# EAGLE design Shield_Proto (EAGLE 9.4.0)
COMPANY: Unexpected Maker; DATE: 24-10-2018; DRAWN: Seon; REV: V1; TITLE: TinyPICO
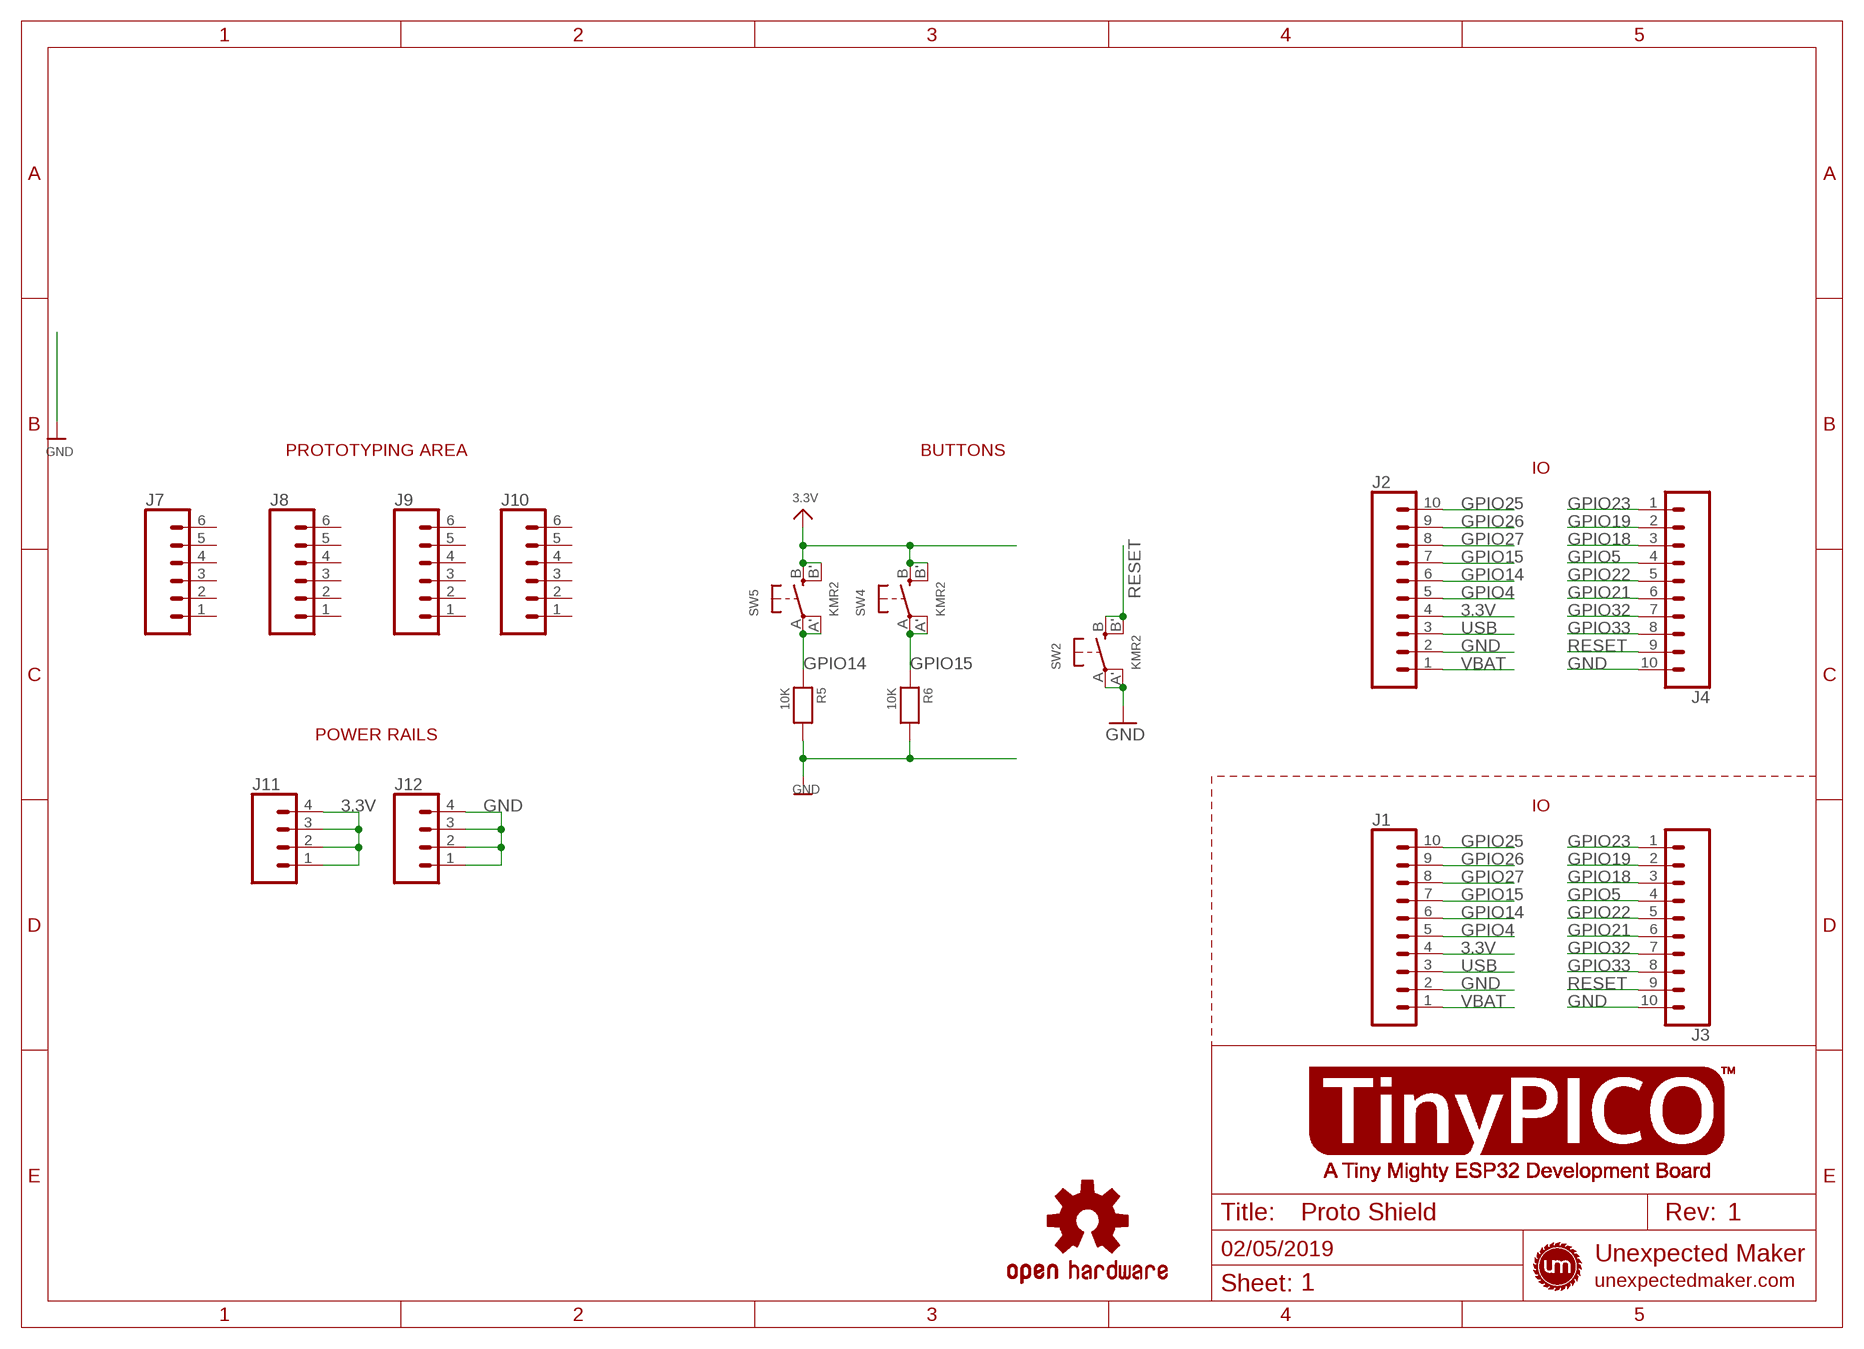
[diagram p0: schematic, sheet 1]
FRAME2 (FRAME_A4_TINYPICO): CDATE: 02/05/2019; REV: 1; SHEET_NUM: 1; TITLE: Proto Shield

## Parts
J1  TINYPICO_HEADER_10NO_SILK_PTH_FEMALE  [1X10_NO_SILK]
J2  TINYPICO_HEADER_10NO_SILK_PTH_FEMALE  [1X10_NO_SILK]
J3  TINYPICO_HEADER_10NO_SILK_PTH_FEMALE  [1X10_NO_SILK]
J4  TINYPICO_HEADER_10NO_SILK_PTH_FEMALE  [1X10_NO_SILK]
J7  CONNECTORS_CONN_06NO_SILK_NO_POP  [SPARKFUN-CONNECTORS_1X06_NO_SILK]
J8  CONNECTORS_CONN_06NO_SILK_NO_POP  [SPARKFUN-CONNECTORS_1X06_NO_SILK]
J9  CONNECTORS_CONN_06NO_SILK_NO_POP  [SPARKFUN-CONNECTORS_1X06_NO_SILK]
J10  CONNECTORS_CONN_06NO_SILK_NO_POP  [SPARKFUN-CONNECTORS_1X06_NO_SILK]
J11  CONN_041X04_NO_SILK  [1X04_NO_SILK]
J12  CONN_041X04_NO_SILK  [1X04_NO_SILK]
LOGO1  OSHW-LOGOS  [OSHW-LOGO-S]
R5  10K  RESISTOR_0603MP  [_0603MP]
R6  10K  RESISTOR_0603MP  [_0603MP]
SW2  KMR2  SWITCH_TACT_SMT4.6X2.8  [BTN_KMR2_4.6X2.8]
SW4  KMR2  SWITCH_TACT_SMT4.6X2.8  [BTN_KMR2_4.6X2.8]
SW5  KMR2  SWITCH_TACT_SMT4.6X2.8  [BTN_KMR2_4.6X2.8]

## Nets
3.3V: J1.4 J2.4 J11.1 J11.2 J11.3 J11.4 SW4.B'(S1) SW4.B(S) SW5.B'(S1) SW5.B(S)
GND: J1.2 J2.2 J3.10 J4.10 J12.1 J12.2 J12.3 J12.4 R5.2 R6.2 SW2.A'(P1) SW2.A(P)
GPIO4: J1.5 J2.5
GPIO5: J3.4 J4.4
GPIO14: J1.6 J2.6 R5.1 SW5.A'(P1) SW5.A(P)
GPIO15: J1.7 J2.7 R6.1 SW4.A'(P1) SW4.A(P)
GPIO18: J3.3 J4.3
GPIO19: J3.2 J4.2
GPIO21: J3.6 J4.6
GPIO22: J3.5 J4.5
GPIO23: J3.1 J4.1
GPIO25: J1.10 J2.10
GPIO26: J1.9 J2.9
GPIO27: J1.8 J2.8
GPIO32: J3.7 J4.7
GPIO33: J3.8 J4.8
RESET: J3.9 J4.9 SW2.B'(S1) SW2.B(S)
USB: J1.3 J2.3
VBAT: J1.1 J2.1
Unconnected: J7.1 J7.2 J7.3 J7.4 J7.5 J7.6 J8.1 J8.2 J8.3 J8.4 J8.5 J8.6 J9.1 J9.2 J9.3 J9.4 J9.5 J9.6 J10.1 J10.2 J10.3 J10.4 J10.5 J10.6

## Notes on the sheet
- PROTOTYPING AREA | BUTTONS
- IO
- POWER RAILS
- IO

## Library data of the parts
J1-J4 = UnexpectedMaker:TINYPICO_HEADER_10: Multi connection point. Often used as Generic Header-pin footprint for 0.1 inch spaced/style header connections On any of the 0.1 inch spaced packages, you can populate with these: Break Away Headers - Straight <https://www.sparkfun.com/products/116> (PRT-00116) Break Away Male Headers - Right Angle <https://www.sparkfun.com/products/553> (PRT-00553) Female Headers <https://www.sparkfun.com/products/115> (PRT-00115) Break Away Headers - Machine Pin <https://www.sparkfun.com/products/117> (PRT-00117) Break Away Female Headers - Swiss Machine Pin <https://www.sparkfun.com/products/743> (PRT-00743) Arduino Stackable Header - 10 Pin <https://www.sparkfun.com/products/11376> (PRT-11376) For SCREWTERMINALS and SPRING TERMINALS visit here: Screw Terimnals on SparkFun.com <https://www.sparkfun.com/search/results?term=Screw+Terminals> (5mm/3.5mm/2.54mm spacing) This device is also useful as a general connection point to wire up your design to another part of your project. Our various solder wires solder well into these plated through hole pads. Hook-Up Wire - Assortment (Stranded, 22 AWG) <https://www.sparkfun.com/products/11375> (PRT-11375) Hook-Up Wire - Assortment (Solid Core, 22 AWG) <https://www.sparkfun.com/products/11367> (PRT-11367) View the entire wire category on our website here <https://www.sparkfun.com/categories/141> Special notes: Molex polarized connector foot print use with SKU : PRT-08231 with associated crimp pins and housings. 1MM SMD Version SKU: PRT-10208 NOTES ON THE VARIANTS LOCK and LOCK_LONGPADS... This footprint was designed to help hold the alignment of a through-hole component (i.e. 6-pin header) while soldering it into place. You may notice that each hole has been shifted either up or down by 0.005 of an inch from it's more standard position (which is a perfectly straight line). This slight alteration caused the pins (the squares in the middle) to touch the edges of the holes. Because they are alternating, it causes a "brace" to hold the component in place. 0.005 has proven to be the perfect amount of "off-center" position when using our standard breakaway headers. Although looks a little odd when you look at the bare footprint, once you have a header in there, the alteration is very hard to notice. Also,if you push a header all the way into place, it is covered up entirely on the bottom side.; PROD_ID: CONN-11563
J7-J10 = NanoPICO:CONNECTORS_CONN_06: Multi connection point. Often used as Generic Header-pin footprint for 0.1 inch spaced/style header connections On any of the 0.1 inch spaced packages, you can populate with these: Break Away Headers - Straight <https://www.sparkfun.com/products/116> (PRT-00116) Break Away Male Headers - Right Angle <https://www.sparkfun.com/products/553> (PRT-00553) Female Headers <https://www.sparkfun.com/products/115> (PRT-00115) Break Away Headers - Machine Pin <https://www.sparkfun.com/products/117> (PRT-00117) Break Away Female Headers - Swiss Machine Pin <https://www.sparkfun.com/products/743> (PRT-00743) Arduino Stackable Header - 6 Pin <https://www.sparkfun.com/products/9280> (PRT-09280) For SCREWTERMINALS and SPRING TERMINALS visit here: Screw Terimnals on SparkFun.com <https://www.sparkfun.com/search/results?term=Screw+Terminals> (5mm/3.5mm/2.54mm spacing) This device is also useful as a general connection point to wire up your design to another part of your project. Our various solder wires solder well into these plated through hole pads. Hook-Up Wire - Assortment (Stranded, 22 AWG) <https://www.sparkfun.com/products/11375> (PRT-11375) Hook-Up Wire - Assortment (Solid Core, 22 AWG) <https://www.sparkfun.com/products/11367> (PRT-11367) View the entire wire category on our website here <https://www.sparkfun.com/categories/141>
J11 J12 = SparkFun-Connectors:CONN_04: Multi connection point. Often used as Generic Header-pin footprint for 0.1 inch spaced/style header connections On any of the 0.1 inch spaced packages, you can populate with these: Break Away Headers - Straight <https://www.sparkfun.com/products/116> (PRT-00116) Break Away Male Headers - Right Angle <https://www.sparkfun.com/products/553> (PRT-00553) Female Headers <https://www.sparkfun.com/products/115> (PRT-00115) Break Away Headers - Machine Pin <https://www.sparkfun.com/products/117> (PRT-00117) Break Away Female Headers - Swiss Machine Pin <https://www.sparkfun.com/products/743> (PRT-00743) For SCREWTERMINALS and SPRING TERMINALS visit here: Screw Terimnals on SparkFun.com <https://www.sparkfun.com/search/results?term=Screw+Terminals> (5mm/3.5mm/2.54mm spacing) This device is also useful as a general connection point to wire up your design to another part of your project. Our various solder wires solder well into these plated through hole pads. Hook-Up Wire - Assortment (Stranded, 22 AWG) <https://www.sparkfun.com/products/11375> (PRT-11375) Hook-Up Wire - Assortment (Solid Core, 22 AWG) <https://www.sparkfun.com/products/11367> (PRT-11367) View the entire wire category on our website here <https://www.sparkfun.com/categories/141> Special notes: Molex polarized connector foot print use with SKU : PRT-08231 with associated crimp pins and housings. 1MM SMD Version SKU: PRT-10208; PROD_ID: CONN-09696
LOGO1 = SparkFun-Aesthetics:OSHW-LOGO: Open-Source Hardware (OSHW) Logo This logo indicates the piece of hardware it is found on incorporates a OSHW license and/or adheres to the definition of open source hardware found here: http://freedomdefined.org/OSHW
R5 R6 = microbuilder:RESISTOR: Resistors For new designs, use the packages preceded by an '_' character since they are more reliable: The following footprints should be used on most boards: _0402 - Standard footprint for regular board layouts _0603 - Standard footprint for regular board layouts _0805 - Standard footprint for regular board layouts _1206 - Standard footprint for regular board layouts For extremely tight-pitch boards where space is at a premium, the following 'micro-pitch' footprints can be used (smaller pads, no silkscreen outline, etc.): _0402MP - Micro-pitch footprint for very dense/compact boards _0603MP - Micro-pitch footprint for very dense/compact boards _0805MP - Micro-pitch footprint for very dense/compact boards _1206MP - Micro-pitch footprint for very dense/compact boards
SW2 SW4 SW5 = microbuilder:SWITCH_TACT_SMT: SMT Tact Switches 6x6mm - Digikey: P12940SCT-ND KMR2 (4.6x2.8mm) - Digikey: 401-1426-1-ND EVQ-PQHB55 - Light Touch, 160GF (4.5x4.5mm) - Digikey: P8090SCT-ND KMT0 - KMT021 NGJ LHS (etc.) IP68/Waterproof - Digikey: CKN10289CT-ND

## Board
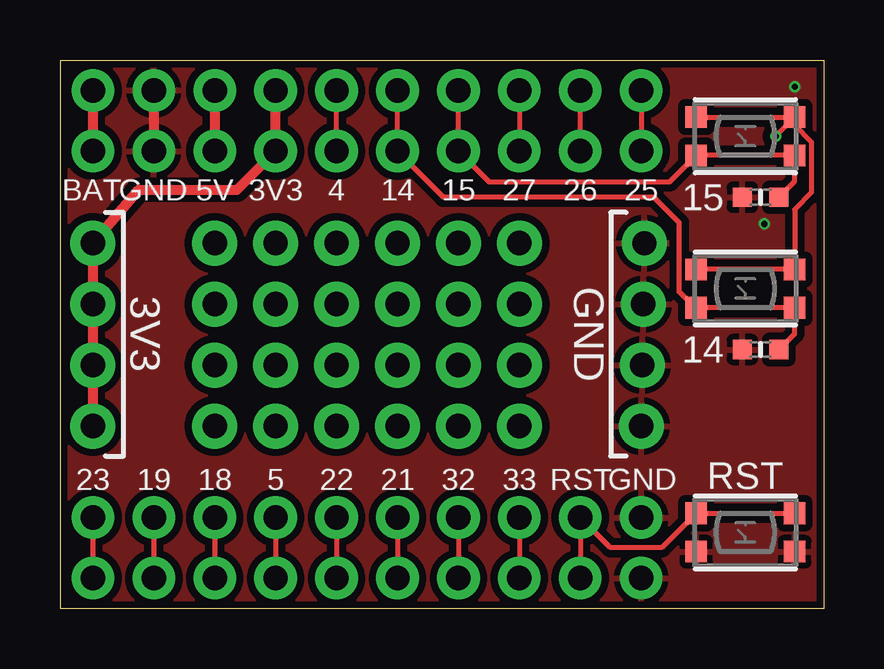
[diagram p1: board, top side]
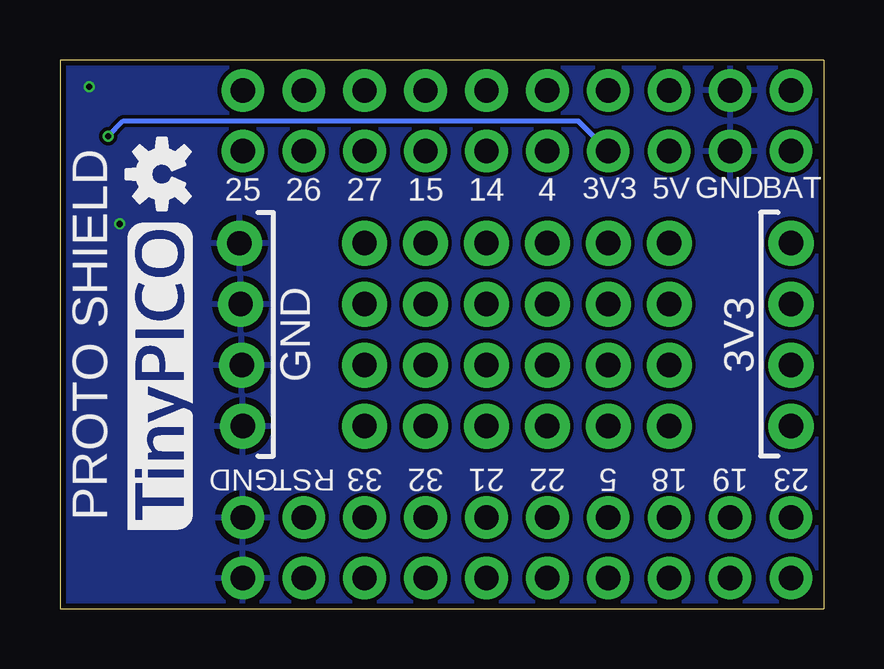
[diagram p2: board, bottom side, seen from below]

Size 31.85 x 22.86 mm. Coordinates in mm from the lower left corner, seen from the top.
Outline: 31.85,0 0,0 0,22.86 31.85,22.86 31.85,0
Copper layers (1*16): Top 0.035mm / dielectric 1.5mm / Bottom 0.035mm
Design rules "UnexpectedMaker_JLCPCB 2 Layer": minimum track width 6mil, minimum drill 10mil, track to track 6mil, track to pad 6mil, pad to pad 6mil, via to via 6mil, smd to smd 6mil, copper to edge 9mil, drill to drill 7mil, minimum pad ring 4mil, minimum via ring 4mil, stop-mask expansion 4mil, vias tented up to drill 25mil, thermal gap 10mil

### Footprints (pad centres in the part's own frame; a part is rotated, then mirrored left to right if it is on the bottom)
1X10_NO_SILK = drill 1.016 pad 1.778: 1 0,0; 2 2.54,0; 3 5.08,0; 4 7.62,0; 5 10.16,0; 6 12.7,0; 7 15.24,0; 8 17.78,0; 9 20.32,0; 10 22.86,0
SPARKFUN-CONNECTORS_1X06_NO_SILK = drill 1.016 pad 1.88: 1 0,0; 2 2.54,0; 3 5.08,0; 4 7.62,0; 5 10.16,0; 6 12.7,0
1X04_NO_SILK = drill 1.016 pad 1.88: 1 0,0; 2 2.54,0; 3 5.08,0; 4 7.62,0
_0603MP = smd 0.8 x 0.8: 1 -0.762,0; 2 0.762,0
BTN_KMR2_4.6X2.8 = smd 0.9 x 0.9: A 2.05,0.8; A' -2.05,0.8; B 2.05,-0.8; B' -2.05,-0.8

### Placement (x,y rotation side)
J1  1.37,19.06 0 top
J2  1.37,21.59 0 top
J3  1.37,3.8 0 top
J4  1.37,1.27 0 top
J7  6.45,7.61 0 top
J8  6.45,10.15 0 top
J9  6.45,12.69 0 top
J10  6.45,15.23 0 top
J11  1.37,7.61 90 top
J12  24.23,7.61 89 top
LOGO1  27.6,18.1 90 bottom
R5  29.21,10.79 180 top
R6  29.21,17.14 180 top
SW2  28.57,3.18 180 top
SW4  28.57,19.68 180 top
SW5  28.57,13.34 180 top

### Tracks (layer width: path | path; a pad name or v marks a point on that pad's centre or on a via)
3.3V  (via drill 0.25)
  Top 0.203: SW5.B SW5.B' 30.62,16.64 31.33,17.34 31.33,19.44 30.62,20.14 SW4.B' | SW4.B SW4.B' | v29.84,19.68 29.84,19.71 SW4.B'
  Top 0.406: J11.1 J11.2 J11.3 J11.4 3.28,17.45 7.38,17.45 J1.4 J2.4
  Bottom 0.203: v29.84,19.68 29.21,20.32 10.25,20.32 J1.4
GND  (via drill 0.25)
  Top 0.406: J2.2 J1.2
  other vias: 29.36,16.03 30.63,21.74
  pour Top (isolate 0.305): -0.85,23.18 -0.85,-0.97 32.17,-0.97 32.17,23.18
  pour Bottom: 32.38,24.13 32.38,-0.64 -1.27,-0.64 -1.27,24.13
GPIO4
  Top 0.203: J1.5 J2.5
GPIO5
  Top 0.203: J3.4 J4.4
GPIO14
  Top 0.203: R5.1 30.62,11.45 SW5.A' SW5.A 26.48,12.54 25.82,13.19 25.82,16.09 24.77,17.14 15.99,17.14 J1.6 J2.6
GPIO15
  Top 0.203: R6.1 30.62,17.8 SW4.A' SW4.A 25.42,17.78 17.89,17.78 J1.7 J2.7
GPIO18
  Top 0.203: J3.3 J4.3
GPIO19
  Top 0.203: J3.2 J4.2
GPIO21
  Top 0.203: J3.6 J4.6
GPIO22
  Top 0.203: J3.5 J4.5
GPIO23
  Top 0.203: J3.1 J4.1
GPIO25
  Top 0.203: J2.10 J1.10
GPIO26
  Top 0.203: J1.9 J2.9
GPIO27
  Top 0.203: J2.8 J1.8
GPIO32
  Top 0.203: J3.7 J4.7
GPIO33
  Top 0.203: J3.8 J4.8
RESET
  Top 0.203: SW2.B' SW2.B 25.09,2.54 22.95,2.54 J3.9 J4.9
USB
  Top 0.406: J2.3 J1.3
VBAT
  Top 0.406: J2.1 J1.1

### Text on the board
bPlace: PROTO SHIELD
tNames: BAT | GND | 5V | 3V3 | 4 | 14 | 15 | 27 | 26 | 25 | 15 | 3V3 | GND | 14 | 23 | 19 | 18 | 5 | 22 | 21 | 32 | 33 | RST | GND | RST
bNames: BAT | GND | 5V | 3V3 | 4 | 14 | 15 | 27 | 26 | 25 | 3V3 | GND | RST | GND | 23 | 19 | 18 | 5 | 22 | 21 | 32 | 33